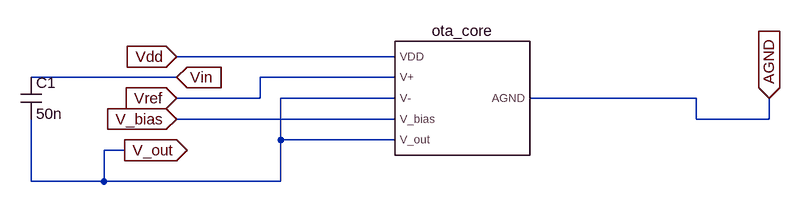
[diagram p0: schematic ota_c_highpass.asc]
ota_c_highpass.asc, the LTspice schematic file:
Version 4.1
SHEET 1 880 680
WIRE -64 224 -400 224
WIRE -400 256 -624 256
WIRE -64 256 -272 256
WIRE -272 288 -272 256
WIRE -272 288 -400 288
WIRE -64 288 -240 288
WIRE 400 288 144 288
WIRE -64 320 -400 320
WIRE 400 320 400 288
WIRE 512 320 512 288
WIRE 512 320 400 320
WIRE -240 352 -240 288
WIRE -64 352 -240 352
WIRE -480 368 -512 368
WIRE -624 416 -624 320
WIRE -512 416 -512 368
WIRE -512 416 -624 416
WIRE -240 416 -240 352
WIRE -240 416 -512 416
FLAG -400 224 Vdd
IOPIN -400 224 In
FLAG 512 288 AGND
IOPIN 512 288 In
FLAG -400 320 V_bias
IOPIN -400 320 In
FLAG -400 256 Vin
IOPIN -400 256 In
FLAG -400 288 Vref
IOPIN -400 288 In
FLAG -480 368 V_out
IOPIN -480 368 Out
SYMBOL ota_core 32 288 R0
SYMATTR InstName ota_core
SYMBOL cap -640 256 R0
SYMATTR InstName C1
SYMATTR Value 50n

The netlist it stands for:
* ota_c_highpass.asc
X§ota_core Vdd Vref V_out V_bias V_out AGND ota_core  ; pins VDD V+ V- V_bias V_out AGND
C1 Vin V_out 50n
.backanno
.end